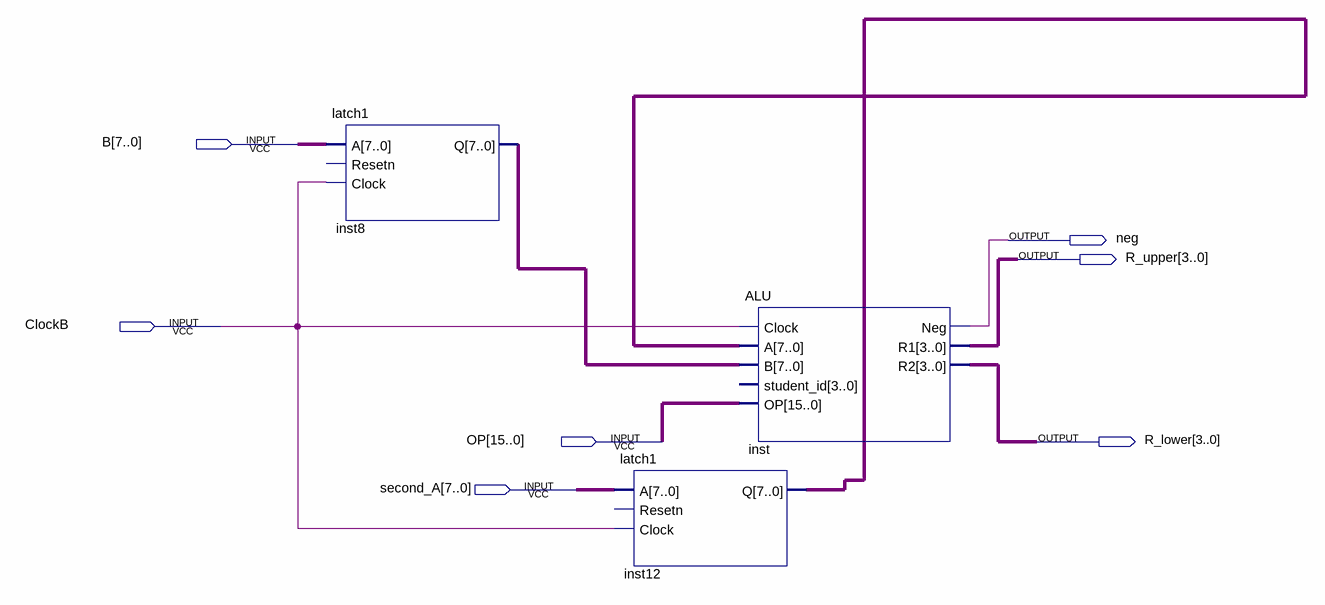
[diagram p0: schematic sheet]
// Quartus schematic alutest.bdf as structural Verilog: 3 symbols, 7 pins
module alutest (
  input  [7:0] B,
  input  ClockB,
  input  [15:0] OP,
  input  [7:0] second_A,
  output neg,
  output [3:0] R_upper,
  output [3:0] R_lower
);

  wire [7:0] inst8_q, inst12_q;

  latch1 inst8 (.A(B), .Clock(ClockB), .Q(inst8_q));  // open: Resetn
  latch1 inst12 (.A(second_A), .Clock(ClockB), .Q(inst12_q));  // open: Resetn
  ALU inst (
    .Clock(ClockB), .A(inst12_q), .B(inst8_q), .OP(OP), .Neg(neg), .R1(R_upper), .R2(R_lower));  // open: student_id
endmodule
